# EAGLE design 50-1-1 (EAGLE 9.6.2)
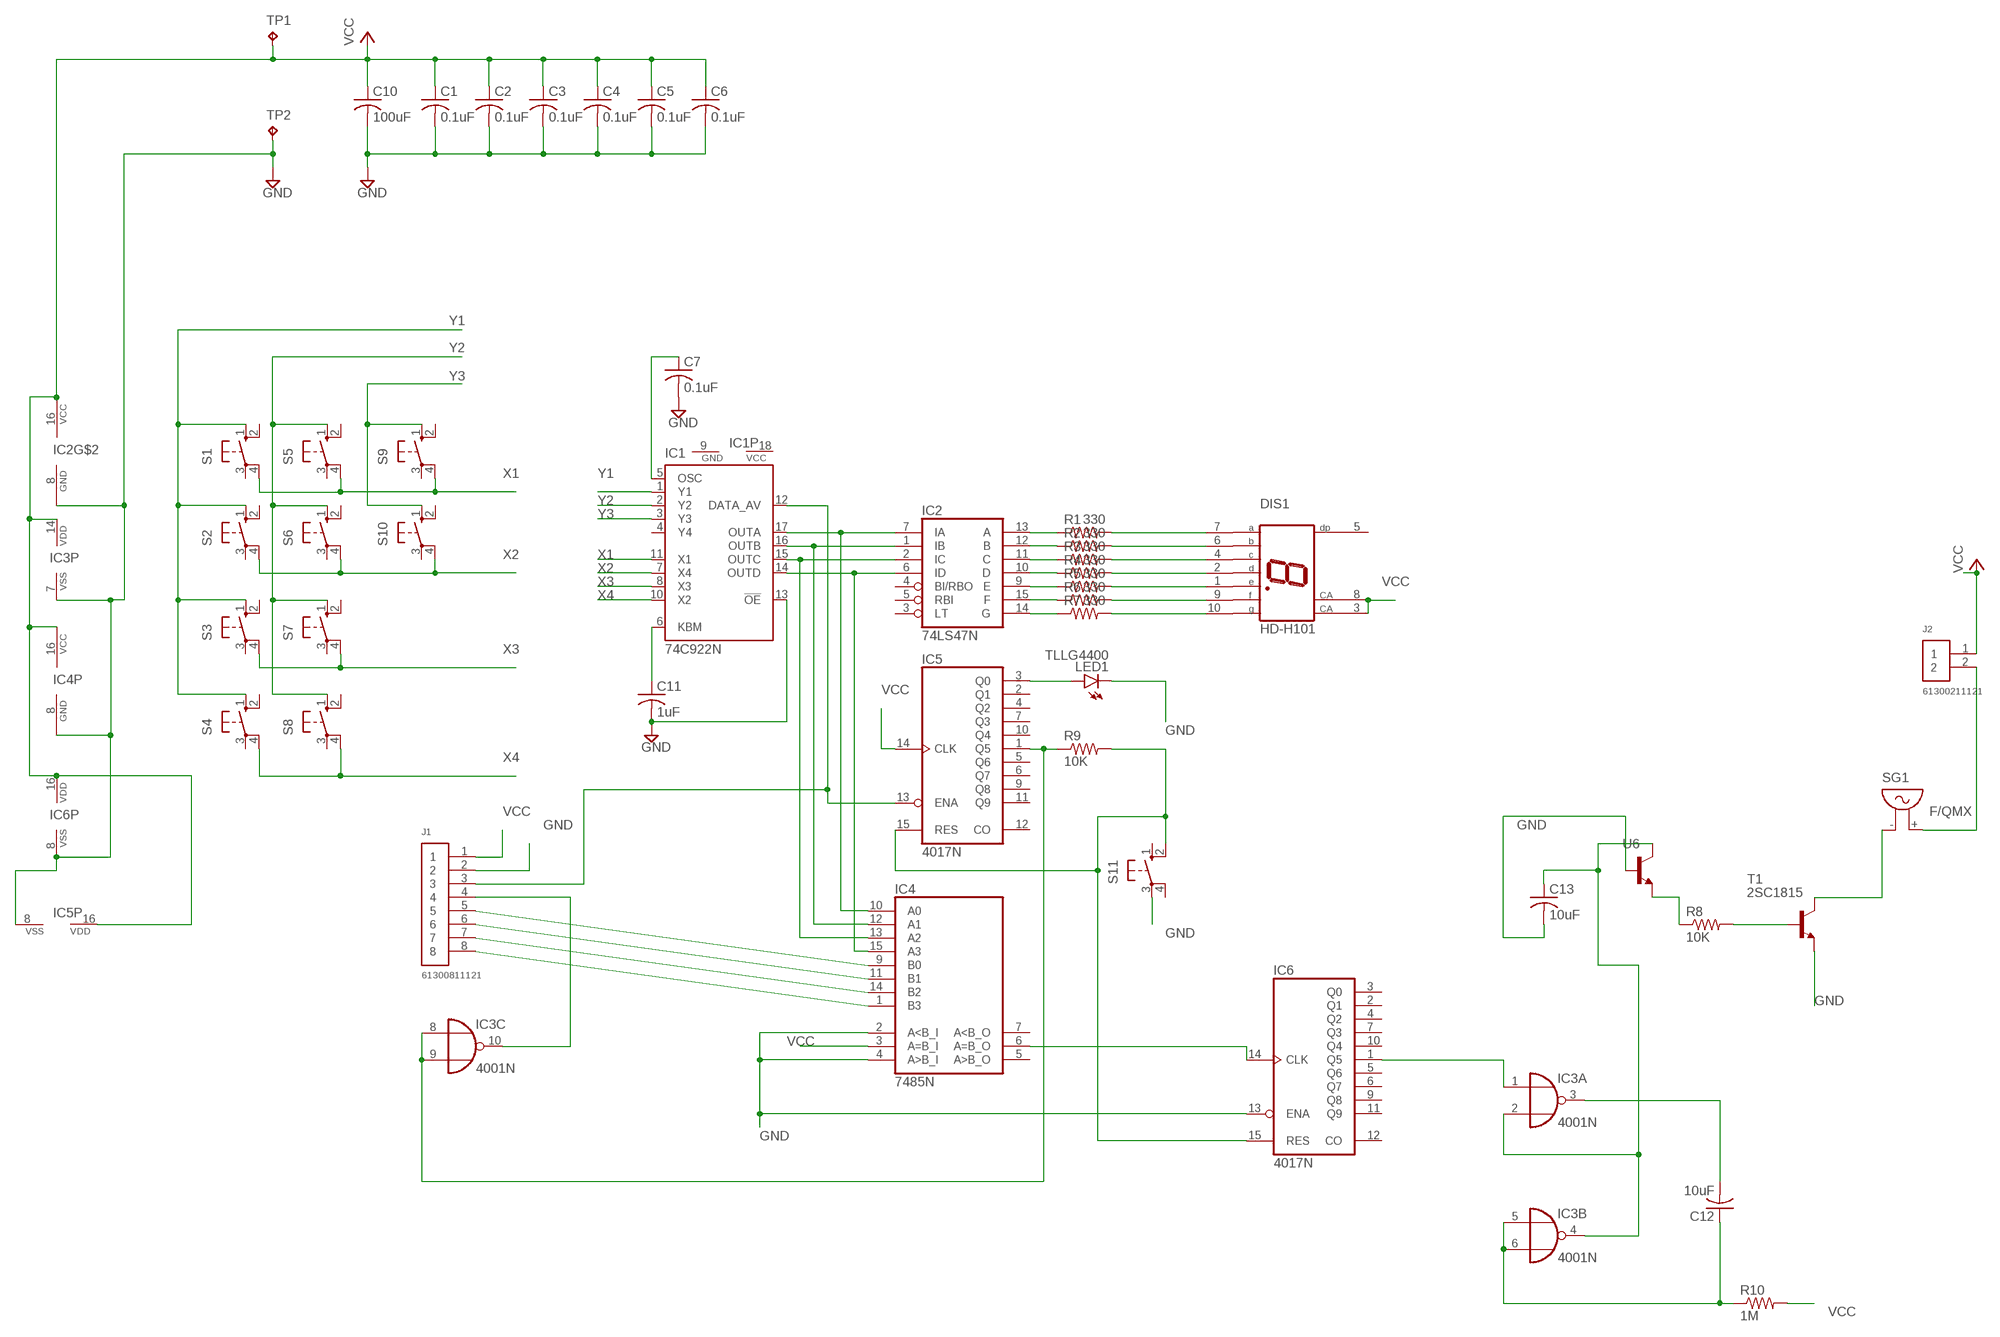
[diagram p0: schematic, sheet 1]

## Parts
C1  0.1uF  C-US050-024X044  [C050-024X044]
C2  0.1uF  C-US050-024X044  [C050-024X044]
C3  0.1uF  C-US050-024X044  [C050-024X044]
C4  0.1uF  C-US050-024X044  [C050-024X044]
C5  0.1uF  C-US050-024X044  [C050-024X044]
C6  0.1uF  C-US050-024X044  [C050-024X044]
C7  0.1uF  C-US050-024X044  [C050-024X044]
C10  100uF  C-US025-050X050  [C025-050X050]
C11  1uF  C-US025-050X050  [C025-050X050]
C12  10uF  C-US025-050X050  [C025-050X050]
C13  10uF  C-US025-050X050  [C025-050X050]
DIS1  HD-H101  [HDSP-M]
IC1  74C922N  [DIL18]
IC2  74LS47N  [DIL16]
IC3  4001N  [DIL14]
IC4  7485N  [DIL16]
IC5  4017N  [DIL16]
IC6  4017N  [DIL16]
J1  61300811121  [61300811121]
J2  61300211121  [61300211121]
LED1  TLLG4400  [LED3MM]
R1  330  R-US_0204/5  [0204/5]
R2  330  R-US_0204/5  [0204/5]
R3  330  R-US_0204/5  [0204/5]
R4  330  R-US_0204/5  [0204/5]
R5  330  R-US_0204/5  [0204/5]
R6  330  R-US_0204/5  [0204/5]
R7  330  R-US_0204/5  [0204/5]
R8  10K  R-US_0204/5  [0204/5]
R9  10K  R-US_0204/5  [0204/5]
R10  1M  R-US_0204/5  [0204/5]
S1  10-XX  [B3F-10XX]
S2  10-XX  [B3F-10XX]
S3  10-XX  [B3F-10XX]
S4  10-XX  [B3F-10XX]
S5  10-XX  [B3F-10XX]
S6  10-XX  [B3F-10XX]
S7  10-XX  [B3F-10XX]
S8  10-XX  [B3F-10XX]
S9  10-XX  [B3F-10XX]
S10  10-XX  [B3F-10XX]
S11  10-XX  [B3F-10XX]
SG1  F/QMX  [F/QMX]
T1  2SC1815  [TO92-ECB]
TP1  TPPAD1-13  [P1-13]
TP2  TPPAD1-13  [P1-13]
U6  -NPN-TO92-BCE  [TO92-BCE]

## Nets
GND: C1.2 C2.2 C3.2 C4.2 C5.2 C6.2 C7.2 C10.2 C11.2 C13.2 IC1.13(!OE) IC2.8(GND) IC3.7(P:VSS) IC4.2(A<B_I) IC4.4(A>B_I) IC4.8(GND) IC5.8(VSS) IC6.8(VSS) IC6.13(ENA) J1.2 LED1.K(C) S11.3(P) T1.E TP2.TP U6.B
N$1: C11.1 IC1.6(KBM)
N$2: C7.1 IC1.5(OSC)
N$3: IC1.17(OUTA) IC2.7(IA) IC4.10(A0)
N$4: IC1.16(OUTB) IC2.1(IB) IC4.12(A1)
N$5: IC1.15(OUTC) IC2.2(IC) IC4.13(A2)
N$6: IC1.14(OUTD) IC2.6(ID) IC4.15(A3)
N$7: IC3.8(C:I0) IC3.9(C:I1) IC5.1(Q5) R9.1
N$8: IC5.3(Q0) LED1.A
N$9: IC4.6(A=B_O) IC6.14(CLK)
N$10: IC5.15(RES) IC6.15(RES) R9.2 S11.2(S1)
N$11: IC3.10(C:O) J1.4
N$12: IC4.1(B3) J1.8
N$13: IC4.14(B2) J1.7
N$14: IC4.11(B1) J1.6
N$15: IC4.9(B0) J1.5
N$16: IC1.12(DATA_AV) IC5.13(ENA) J1.3
N$17: IC2.13(A) R1.1
N$18: IC2.12(B) R2.1
N$19: IC2.11(C) R3.1
N$20: IC2.10(D) R4.1
N$21: IC2.9(E) R5.1
N$22: IC2.15(F) R6.1
N$23: IC2.14(G) R7.1
N$24: DIS1.7(A) R1.2
N$25: DIS1.6(B) R2.2
N$26: DIS1.4(C) R3.2
N$27: DIS1.2(D) R4.2
N$28: DIS1.1(E) R5.2
N$29: DIS1.9(F) R6.2
N$30: DIS1.10(G) R7.2
N$31: IC3.1(A:I0) IC6.1(Q5)
N$32: C13.1 IC3.2(A:I1) IC3.4(B:O) U6.C
N$33: C12.1 IC3.5(B:I0) IC3.6(B:I1) R10.1
N$34: C12.2 IC3.3(A:O)
N$35: R8.1 U6.E
N$36: R8.2 T1.B
N$37: SG1.- T1.C
N$38: J2.2 SG1.+
VCC: C1.1 C2.1 C3.1 C4.1 C5.1 C6.1 C10.1 DIS1.3(CA) DIS1.8(CA) IC2.16(VCC) IC3.14(P:VDD) IC4.3(A=B_I) IC4.16(VCC) IC5.14(CLK) IC5.16(VDD) IC6.16(VDD) J1.1 J2.1 R10.2 TP1.TP
X1: IC1.11(X1) S1.4(P1) S5.4(P1) S9.4(P1)
X2: IC1.7(X4) S2.4(P1) S6.4(P1) S10.4(P1)
X3: IC1.8(X3) S3.4(P1) S7.4(P1)
X4: IC1.10(X2) S4.4(P1) S8.4(P1)
Y1: IC1.1(Y1) S1.1(S) S2.1(S) S3.1(S) S4.1(S)
Y2: IC1.2(Y2) S5.1(S) S6.1(S) S7.1(S) S8.1(S)
Y3: IC1.3(Y3) S9.1(S) S10.1(S)
Unconnected: DIS1.5(DP) IC1.4(Y4) IC2.3(LT) IC2.4(BI/RBO) IC2.5(RBI) IC3.11(D:O) IC3.12(D:I0) IC3.13(D:I1) IC4.5(A>B_O) IC4.7(A<B_O) IC5.2(Q1) IC5.4(Q2) IC5.5(Q6) IC5.6(Q7) IC5.7(Q3) IC5.9(Q8) IC5.10(Q4) IC5.11(Q9) IC5.12(CO) IC6.2(Q1) IC6.3(Q0) IC6.4(Q2) IC6.5(Q6) IC6.6(Q7) IC6.7(Q3) IC6.9(Q8) IC6.10(Q4) IC6.11(Q9) IC6.12(CO) S1.2(S1) S1.3(P) S2.2(S1) S2.3(P) S3.2(S1) S3.3(P) S4.2(S1) S4.3(P) S5.2(S1) S5.3(P) S6.2(S1) S6.3(P) S7.2(S1) S7.3(P) S8.2(S1) S8.3(P) S9.2(S1) S9.3(P) S10.2(S1) S10.3(P) S11.1(S) S11.4(P1)

## Power pins joined to a net without a drawn wire
GND: IC1.9(GND)
VCC: IC1.18(VCC)

## Library data of the parts
C1-C7 C10-C13 = rcl:C-US: CAPACITOR, American symbol; SPICEPREFIX: C
DIS1 = display-hp:HD-H101: LED DISPLAY 1-character 7 segment, decimal point right; OC_FARNELL: unknown; OC_NEWARK: unknown
IC1 = 74xx-us:74C922: 16-Key Encoder Source: http://www.national.com/ds/MM/MM54C922.pdf#page=1
IC2 = 74xx-us:74*47: BCD to seven segment DECODER/DRIVER Source: http://www.ee.washington.edu/stores/DataSheets/74ls/74ls47.pdf
IC3 = 40xx:4001: Quad 2-input NOR
IC4 = 74xx-us:74*85: 4-bit magnitude COMPARATOR
IC5 IC6 = 40xx:4017: COUNTER/DIVIDER
J1 = Headers:61300811121: CONN HEADER VERT 8POS 2.54MM Manufacturer's datasheet <https://katalog.we-online.de/em/datasheet/6130xx11121.pdf>; CREATED_BY: PCBLayout.com; DIGI_KEY_PART_NUMBER: 732-5321-ND; MANUFACTURER: Wurth Electronics Inc.; MPN: 61300811121
J2 = Headers:61300211121: CONN HEADER VERT 2POS 2.54MM Manufacturer's datasheet <https://katalog.we-online.de/em/datasheet/6130xx11121.pdf>; CREATED_BY: PCBLayout.com; DIGI_KEY_PART_NUMBER: 732-5315-ND; MANUFACTURER: Wurth Electronics Inc.; MPN: 61300211121
LED1 = led:TLLG4400: Low Current (2mA) LED 3 mm Tinted Diffused Package color GREEN Source: Data sheet <http://www.farnell.com/datasheets/391098.pdf>; MF: VISHAY SEMICONDUCTOR; OC_FARNELL: 1612435
R1-R10 = rcl:R-US_: RESISTOR, American symbol; SPICEPREFIX: R
S1-S11 = switch-omron:10-XX: OMRON SWITCH; MPN: B3F-1000; OC_FARNELL: 176432; OC_NEWARK: 36M3542
SG1 = buzzer:F/QMX: BUZZER Source: Buerklin; OC_FARNELL: unknown; OC_NEWARK: unknown
T1 = transistor:2SC1815: NPN EPITAXIAL TRANSISTOR Source: TOSHIBA .. 2SC1815 1.pdf
TP1 TP2 = testpad:TP: Test pad
U6 = transistor-neu-to92:*-NPN-: NPN Transistror

## Board
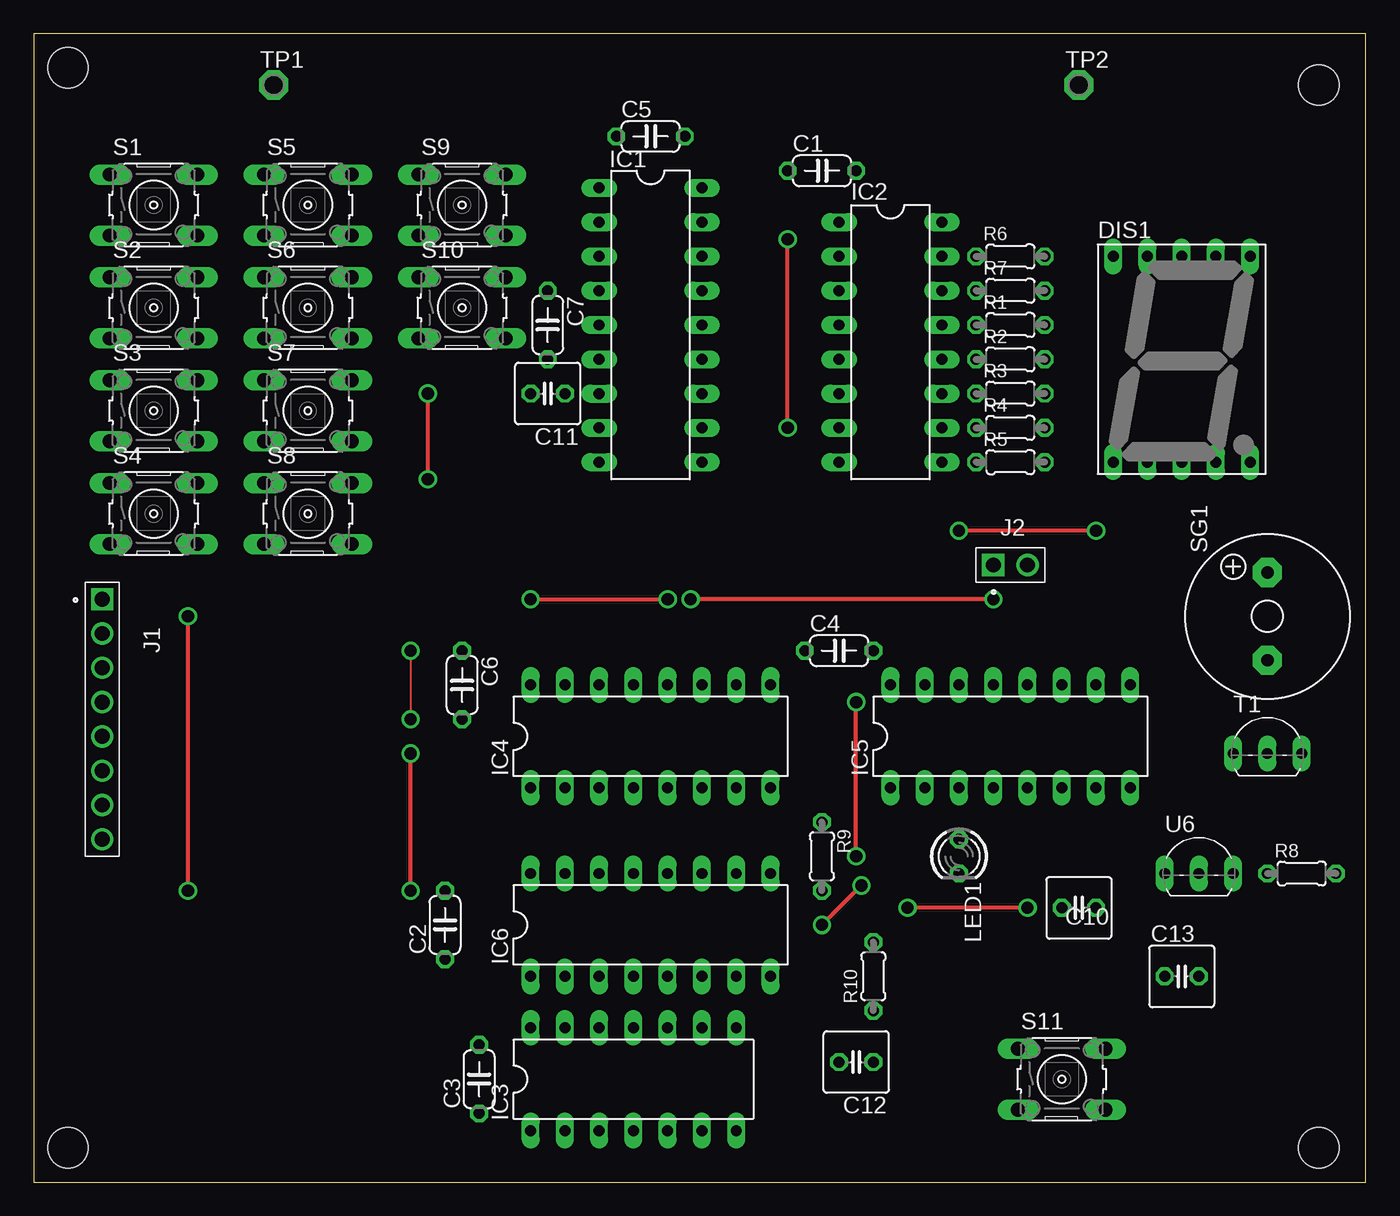
[diagram p1: board, top side]
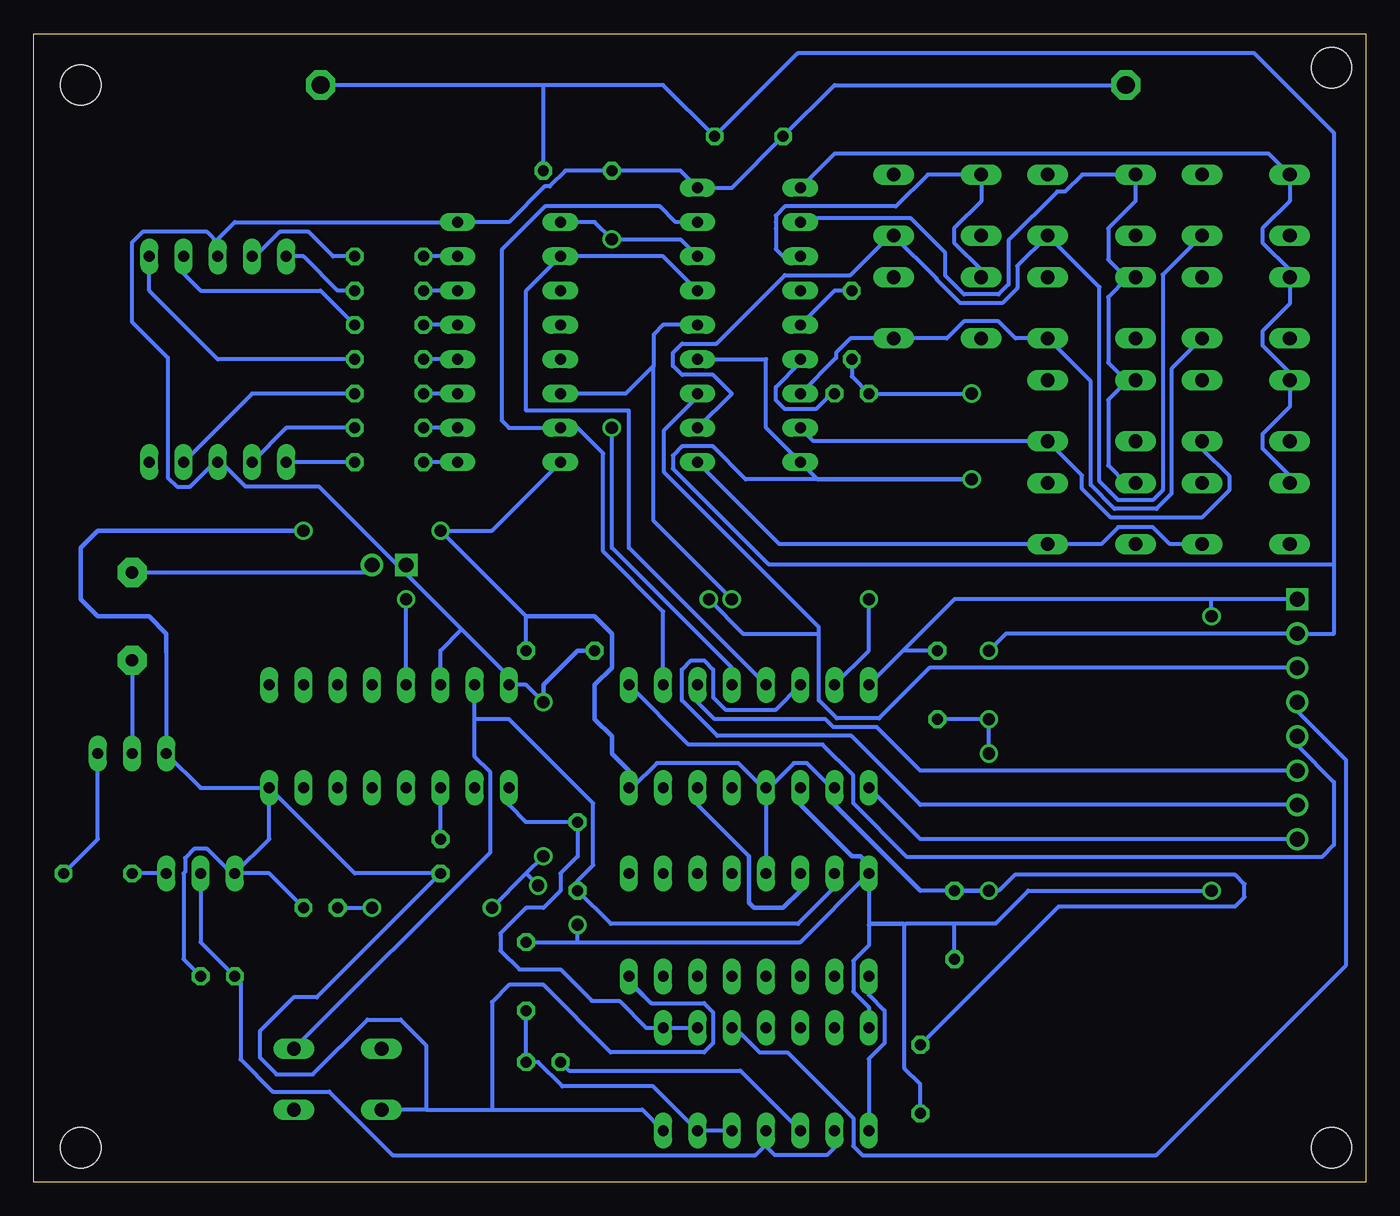
[diagram p2: board, bottom side, seen from below]

Size 98.73 x 85.08 mm. Coordinates in mm from the lower left corner, seen from the top.
Outline: 0,0 98.73,0 98.73,85.08 0,85.08 0,0
Copper layers (1*16): Top 0.035mm / dielectric 1.5mm / Bottom 0.035mm
Design rules "default *": minimum track width 6mil, minimum drill 0.35mm, track to track 0.35mm, track to pad 0.35mm, pad to pad 0.35mm, via to via 0.35mm, smd to smd 0.35mm, copper to edge 40mil, drill to drill 6mil, minimum pad ring 10mil, minimum via ring 8mil, stop-mask expansion 4mil, vias tented up to drill 0mil, thermal gap 10mil
Holes 3 mm at 95.25,81.28 2.54,2.54 2.54,82.55 95.25,2.54

### Footprints (pad centres in the part's own frame; a part is rotated, then mirrored left to right if it is on the bottom)
C050-024X044 = drill 0.813 octagon: 1 -2.54,0; 2 2.54,0
C025-050X050 = drill 0.813 octagon: 1 -1.27,0; 2 1.27,0
HDSP-M = drill 0.813 long: 1 -5.08,-7.62; 2 -2.54,-7.62; 3 0,-7.62; 4 2.54,-7.62; 5 5.08,-7.62; 6 5.08,7.62; 7 2.54,7.62; 8 0,7.62; 9 -2.54,7.62; 10 -5.08,7.62
DIL18 = drill 0.813 long: 1 -10.16,-3.81; 2 -7.62,-3.81; 3 -5.08,-3.81; 4 -2.54,-3.81; 5 0,-3.81; 6 2.54,-3.81; 7 5.08,-3.81; 8 7.62,-3.81; 9 10.16,-3.81; 10 10.16,3.81; 11 7.62,3.81; 12 5.08,3.81; 13 2.54,3.81; 14 0,3.81; 15 -2.54,3.81; 16 -5.08,3.81; 17 -7.62,3.81; 18 -10.16,3.81
DIL16 = drill 0.813 long: 1 -8.89,-3.81; 2 -6.35,-3.81; 3 -3.81,-3.81; 4 -1.27,-3.81; 5 1.27,-3.81; 6 3.81,-3.81; 7 6.35,-3.81; 8 8.89,-3.81; 9 8.89,3.81; 10 6.35,3.81; 11 3.81,3.81; 12 1.27,3.81; 13 -1.27,3.81; 14 -3.81,3.81; 15 -6.35,3.81; 16 -8.89,3.81
DIL14 = drill 0.813 long: 1 -7.62,-3.81; 2 -5.08,-3.81; 3 -2.54,-3.81; 4 0,-3.81; 5 2.54,-3.81; 6 5.08,-3.81; 7 7.62,-3.81; 8 7.62,3.81; 9 5.08,3.81; 10 2.54,3.81; 11 0,3.81; 12 -2.54,3.81; 13 -5.08,3.81; 14 -7.62,3.81
61300811121 = drill 1.1 square: 1 -8.89,0 | drill 1.1: 2 -6.35,0; 3 -3.81,0; 4 -1.27,0; 5 1.27,0; 6 3.81,0; 7 6.35,0; 8 8.89,0
61300211121 = drill 1.1 square: 1 -1.27,0 | drill 1.1: 2 1.27,0
LED3MM = drill 0.813 octagon: A -1.27,0; K 1.27,0
0204/5 = drill 0.813 octagon: 1 -2.54,0; 2 2.54,0
B3F-10XX = drill 1.016 long: 1 -3.251,2.261; 2 3.251,2.261; 3 -3.251,-2.261; 4 3.251,-2.261
F/QMX = drill 0.914 pad 2.159 octagon: + 3.251,0; - -3.251,0
TO92-ECB = drill 0.813 long: B 2.54,0; C 0,0; E -2.54,0
P1-13 = drill 1.321 pad 2.159 octagon: TP 0,0
TO92-BCE = drill 0.813 long: B -2.54,0; C 0,0; E 2.54,0

### Placement (x,y rotation side)
C1  58.42,74.93 0 top
C2  30.48,19.05 90 top
C3  33.02,7.62 90 top
C4  59.69,39.37 0 top
C5  45.72,77.47 0 top
C6  31.75,36.83 270 top
C7  38.1,63.5 270 top
C10  77.47,20.32 0 top
C11  38.1,58.42 180 top
C12  60.96,8.89 180 top
C13  85.09,15.24 0 top
DIS1  85.09,60.96 0 top
IC1  45.72,63.5 270 top
IC2  63.5,62.23 270 top
IC3  44.45,7.62 0 top
IC4  45.72,33.02 0 top
IC5  72.39,33.02 0 top
IC6  45.72,19.05 0 top
J1  5.08,34.29 270 top
J2  72.39,45.72 0 top
LED1  68.58,24.13 270 top
R1  72.39,63.5 0 top
R2  72.39,60.96 0 top
R3  72.39,58.42 0 top
R4  72.39,55.88 0 top
R5  72.39,53.34 0 top
R6  72.39,68.58 0 top
R7  72.39,66.04 0 top
R8  93.98,22.86 0 top
R9  58.42,24.13 270 top
R10  62.23,15.24 90 top
S1  8.89,72.39 0 top
S2  8.89,64.77 0 top
S3  8.89,57.15 0 top
S4  8.89,49.53 0 top
S5  20.32,72.39 0 top
S6  20.32,64.77 0 top
S7  20.32,57.15 0 top
S8  20.32,49.53 0 top
S9  31.75,72.39 0 top
S10  31.75,64.77 0 top
S11  76.2,7.62 0 top
SG1  91.44,41.91 90 top
T1  91.44,31.75 0 top
TP1  17.78,81.28 0 top
TP2  77.47,81.28 0 top
U6  86.36,22.86 0 top

### Tracks (layer width: path | path; a pad name or v marks a point on that pad's centre or on a via)
GND  (via drill 0.9)
  Top 0.152: v27.94,39.37 v27.94,34.29
  Top 0.3: v29.21,58.42 v29.21,52.07 | v27.94,21.59 v27.94,31.75 | v78.74,48.26 v68.58,48.26
  Bottom 0.3: C7.2 38.1,59.69 C11.2 v29.21,58.42 | IC1.13 44.45,60.96 44.45,55.88 IC1.9 40.64,52.07 v29.21,52.07 45.96,52.07 48.39,54.5 50.67,54.5 51.35,53.82 51.35,52.86 44.27,45.77 2.4,45.77 2.34,45.72 | IC4.2 39.61,29.21 41.43,31.03 42.39,31.03 44.21,29.21 IC4.4 | IC4.4 44.69,29.21 46.51,31.03 52.55,31.03 54.37,29.21 IC4.8 | v27.94,39.37 26.67,40.64 J1.2 2.34,40.64 2.34,45.72 | 60.96,81.28 52.07,81.28 C5.2 42.11,83.62 8.25,83.62 2.34,77.71 2.34,45.72 | 60.96,81.28 TP2.TP | IC4.4 IC6.13 | 69.66,5.36 64.77,5.36 | 64.77,5.36 53.62,5.36 IC3.7 | IC5.8 74.93,22.86 LED1.K 77.76,13.68 79.47,13.68 81.98,11.17 81.98,9.23 80.74,7.98 78.04,7.98 73.99,12.03 71.54,12.03 69.66,10.15 69.66,5.36 | IC5.8 86.36,29.21 T1.E 88.9,39.24 | U6.B 81.28,25.4 IC5.8 | C10.2 81.28,22.86 U6.B | U6.B 84.06,22.86 85.88,24.68 86.84,24.68 87.52,24 87.52,22.97 87.63,22.86 87.63,16.51 C13.2 | 53.52,13.79 52.97,13.25 49.05,13.25 48.37,12.57 48.37,10.29 49.05,9.61 55.96,9.61 60.96,14.61 63.5,14.61 64.77,13.34 64.77,5.36 | C2.2 v27.94,21.59 | v27.94,31.75 v27.94,34.29 C6.2 | IC2.8 64.77,48.26 v68.58,48.26 62.23,41.91 C4.2 | C2.2 27.2,21.59 26.02,22.77 9.67,22.77 8.98,22.08 8.98,21.1 9.67,20.41 22.77,20.41 C3.2 | C1.2 60.96,81.28 | C2.2 33.02,21.59 | 69.66,5.36 S11.3
  Bottom 0.35: v78.74,48.26 93.98,48.26 95.25,46.99 95.25,43.18 93.98,41.91 90.17,41.91 88.9,40.64 88.9,39.24 | IC4.8 54.61,30.48 55.88,31.75 55.88,33.02 57.15,34.29 57.15,36.83 55.88,38.1 55.88,40.64 57.15,41.91 62.23,41.91 | IC4.2 39.37,27.94 33.02,21.59 | 53.52,13.79 54.61,14.89 IC6.8
N$1
  Bottom 0.3: IC1.6 41.91,60.72 43.73,58.9 43.73,57.94 43.05,57.26 40.77,57.26 39.61,58.42 C11.1
N$2
  Bottom 0.3: C7.1 39.37,66.04 IC1.5
N$3
  Bottom 0.3: IC1.17 51.15,71.12 52.31,72.28 60.83,72.28 64.05,69.06 64.05,56.43 63.5,55.88 IC2.7 58.42,55.88 56.53,53.99 56.53,46.72 52.07,42.26 IC4.10
N$4  (via drill 0.9)
  Top 0.3: v55.88,55.88 v55.88,69.85
  Bottom 0.3: IC4.12 46.99,38.1 55.88,46.99 v55.88,55.88 | IC1.16 50.8,69.85 v55.88,69.85 57.15,71.12 IC2.1
N$5
  Bottom 0.3: IC1.15 52.07,68.58 IC2.2 62.23,66.04 62.23,57.15 54.61,57.15 54.61,46.99 IC4.13
N$6  (via drill 0.9)
  Top 0.3: v36.83,43.18 v46.99,43.18
  Bottom 0.3: IC1.14 52.07,63.5 52.79,62.78 52.79,60.48 | IC2.6 54.85,58.42 52.79,60.48 | IC4.15 36.83,39.37 v36.83,43.18 | v46.99,43.18 52.79,48.98 52.79,60.48
N$7
  Bottom 0.3: IC5.1 63.5,27.94 62.23,26.67 R9.1 58.42,24.13 59.69,22.86 59.69,21.59 60.96,20.32 62.23,20.32 64.14,18.41 64.14,17.14 62.74,15.75 59.69,15.75 57.36,13.42 57.28,13.42 55.33,13.42 53.34,11.43 IC3.8 IC3.9
N$8
  Bottom 0.3: LED1.A IC5.3
N$9
  Bottom 0.3: IC4.6 49.53,27.94 45.72,24.13
  Bottom 0.35: IC6.14 41.91,21.59 43.18,20.32 45.34,20.32 45.72,20.7 45.72,24.13
N$10
  Bottom 0.3: IC6.15 39.37,21.83 42.08,19.12 55.95,19.12 R9.2 58.42,22.31 57.26,23.47 57.26,28.05 63.5,34.29 66.04,34.29 | 66.04,34.29 66.04,31.51 64.88,30.35 64.88,24.45 S11.2 | 66.04,34.29 IC5.15
N$11
  Bottom 0.3: IC3.10 46.75,11.43 44.93,9.61 42.87,9.61 37.99,4.73 37.99,2.67 37.31,1.99 15.54,1.99 1.45,16.07 1.45,31.27 5.08,34.89 J1.4
N$12
  Bottom 0.3: J1.8 33.02,25.4 IC4.1
N$13
  Bottom 0.3: J1.7 33.02,27.94 38.14,33.06 48.06,33.06 50.69,35.69 50.69,37.97 50.01,38.65 49.05,38.65 48.37,37.97 48.37,35.91 47.47,35.01 43.73,35.01 IC4.14
N$14
  Bottom 0.3: J1.6 33.02,30.48 36.25,33.71 39.47,33.71 40.05,34.29 48.26,34.29 49.53,35.56 IC4.11
N$15
  Bottom 0.3: IC4.9 50.19,32.41 40.27,32.41 37.99,30.13 37.99,28.07 34,24.07 3.26,24.07 2.36,24.98 2.36,29.63 5.08,32.35 J1.5
N$16  (via drill 0.9)
  Top 0.3: v71.12,43.18 v48.69,43.18
  Bottom 0.3: J1.3 32.34,38.1 36.08,34.36 39.2,34.36 40.53,35.69 40.53,40.64 | IC1.12 49.53,58.18 52,55.71 52,52.59 40.53,41.12 40.53,40.64 | IC5.13 v71.12,43.18 | v48.69,43.18 46.15,40.64 40.53,40.64
N$17
  Bottom 0.3: IC2.13 R1.1
N$18
  Bottom 0.3: IC2.12 R2.1
N$19
  Bottom 0.3: IC2.11 R3.1
N$20
  Bottom 0.3: IC2.10 R4.1
N$21
  Bottom 0.3: IC2.9 R5.1
N$22
  Bottom 0.3: IC2.15 R6.1
N$23
  Bottom 0.3: IC2.14 R7.1
N$24
  Bottom 0.3: R1.2 77.47,66.04 86.36,66.04 87.63,67.31 DIS1.7
N$25
  Bottom 0.3: R2.2 85.09,60.96 90.17,66.04 DIS1.6
N$26
  Bottom 0.3: R3.2 82.55,58.42 DIS1.4
N$27
  Bottom 0.3: R4.2 80.01,55.88 DIS1.2
N$28
  Bottom 0.3: R5.2 DIS1.1
N$29
  Bottom 0.3: R6.2 76.55,68.58 78.37,70.4 80.49,70.4 82.31,68.58 DIS1.9
N$30
  Bottom 0.3: R7.2 76.2,66.04 78.74,68.58 DIS1.10
N$31
  Bottom 0.3: IC6.1 36.83,13.86 35.67,12.7 35.67,10.29 36.83,9.13 IC3.1
N$32
  Bottom 0.3: IC3.2 39.37,2.54 39.92,1.99 43.77,1.99 44.45,2.67 IC3.4 44.45,2.78 45.24,1.99 72.12,1.99 76.83,6.7 81,6.7 83.39,9.09 83.39,14.82 C13.1 86.36,17.78 U6.C
N$33
  Bottom 0.3: IC3.5 IC3.6 52.82,7.1 59.54,7.1 61.33,8.89 C12.1 R10.1
N$34
  Bottom 0.3: IC3.3 46.36,8.26 59.05,8.26 C12.2
N$35
  Bottom 0.3: U6.E R8.1
N$36
  Bottom 0.3: R8.2 93.98,25.4 T1.B
N$37
  Bottom 0.3: SG1.- T1.C
N$38
  Bottom 0.3: J2.2 74.22,45.16 SG1.+
VCC  (via drill 0.9)
  Top 0.3: v73.66,20.32 v64.77,20.32 | v60.96,24.13 v60.96,35.56 | v11.43,21.59 v11.43,41.91 | v58.42,19.05 v61.34,21.97
  Bottom 0.3: J1.1 11.43,43.18 | 11.43,43.18 30.48,43.18 34.29,39.37 | 34.29,39.37 IC4.16 | C6.1 34.29,39.37 | TP1.TP 39.37,81.28 C5.1 46.99,73.66 IC1.18 50.8,74.93 C1.1 59.32,74.93 60.48,73.77 60.85,73.77 63.5,71.12 IC2.16 83.82,71.12 85.09,69.85 DIS1.8 85.09,69.61 85.88,70.4 90.65,70.4 91.46,69.59 91.46,63.76 88.79,61.09 88.79,52.2 88.11,51.52 87.15,51.52 85.33,53.34 DIS1.3 84.85,53.34 83.03,51.52 77.58,51.52 71.45,45.39 | IC3.14 36.83,12.94 37.99,14.1 37.99,16.38 36.83,17.54 36.83,19.05 IC6.16 41.91,17.78 58.42,17.78 | R10.2 58.42,17.78 | 71.45,45.39 67.01,40.94 | 67.01,40.94 63.5,37.43 IC5.16 62.23,36.83 v60.96,35.56 | C10.1 v73.66,20.32 | v64.77,20.32 62.23,22.86 | 62.23,22.86 v60.96,24.13 | 30.48,19.14 27.45,19.14 25.01,21.59 v11.43,21.59 | v11.43,41.91 11.43,43.18 | C3.1 33.02,7.25 34.18,8.41 34.18,19.04 | 58.42,17.78 v58.42,19.05 | v61.34,21.97 62.23,22.86 | 34.18,19.04 34.29,19.14 | C2.1 30.48,19.14 | 30.48,19.14 34.07,19.14 34.18,19.04 | J2.1 71.45,45.39 | IC5.14 68.58,39.37 67.01,40.94
  Bottom 0.35: C4.1 58.42,39.37 60.96,36.83 v60.96,35.56 | 34.29,19.14 36.74,19.14 36.83,19.05 | IC6.16 36.83,23.5 37.47,24.13 38.1,24.13 41.91,27.94 IC4.3
X1
  Bottom 0.3: S1.4 15.04,67.23 15.04,51.27 15.78,50.53 18.35,50.53 19.74,51.92 19.74,66.3 S5.4 25.82,67.88 25.82,66.24 26.95,65.12 30.05,65.12 31.82,66.89 31.82,66.95 S9.4 35.28,70.13 38.21,67.2 43.05,67.2 48.13,62.12 50.67,62.12 51.35,61.44 51.35,60.48 50.67,59.8 48.37,59.8 46.99,58.42 IC1.11
X2
  Bottom 0.3: S2.4 14.39,60.26 14.39,51 15.51,49.88 18.62,49.88 20.39,51.65 20.39,59.33 S6.4 25.95,62.51 27.21,63.77 29.78,63.77 31.05,62.51 S10.4 38.19,62.51 39.26,61.44 39.26,61.07 IC1.7
X3
  Bottom 0.3: S3.4 12.14,54.34 10.12,52.31 10.12,51.27 12.16,49.23 18.89,49.23 21.04,51.38 21.04,52.36 S7.4 40.92,54.89 IC1.8
X4
  Bottom 0.3: S4.4 14.52,47.27 15.78,48.53 18.35,48.53 19.62,47.27 S8.4 43.46,47.27 IC1.10
Y1
  Bottom 0.3: S4.1 5.64,52.34 7.66,54.37 7.66,55.41 5.64,57.44 S3.1 5.64,59.96 7.66,61.99 7.66,63.03 5.64,65.06 S2.1 5.64,67.58 7.66,69.61 7.66,70.65 5.64,72.68 S1.1 7.19,76.2 39.37,76.2 IC1.1
Y2
  Bottom 0.3: S8.1 17.79,51.79 19.09,53.1 19.09,57.95 17.63,59.41 S7.1 17.79,59.41 19.09,60.72 19.09,65.57 17.63,67.03 S6.1 17.79,67.03 19.09,68.34 19.09,70.65 17.07,72.68 S5.1 21.02,74.65 22.29,73.39 22.86,73.39 26.47,69.77 26.47,66.51 27.21,65.77 29.78,65.77 31.17,67.16 31.17,68.85 33.72,71.39 41.64,71.39 IC1.2
Y3
  Bottom 0.3: S10.1 28.5,67.58 30.52,69.61 30.52,70.65 28.5,72.68 S9.1 32.45,74.65 34.83,72.28 43.05,72.28 43.73,71.6 43.73,71.12 43.73,70.64 43.73,69.13 43.18,68.58 IC1.3